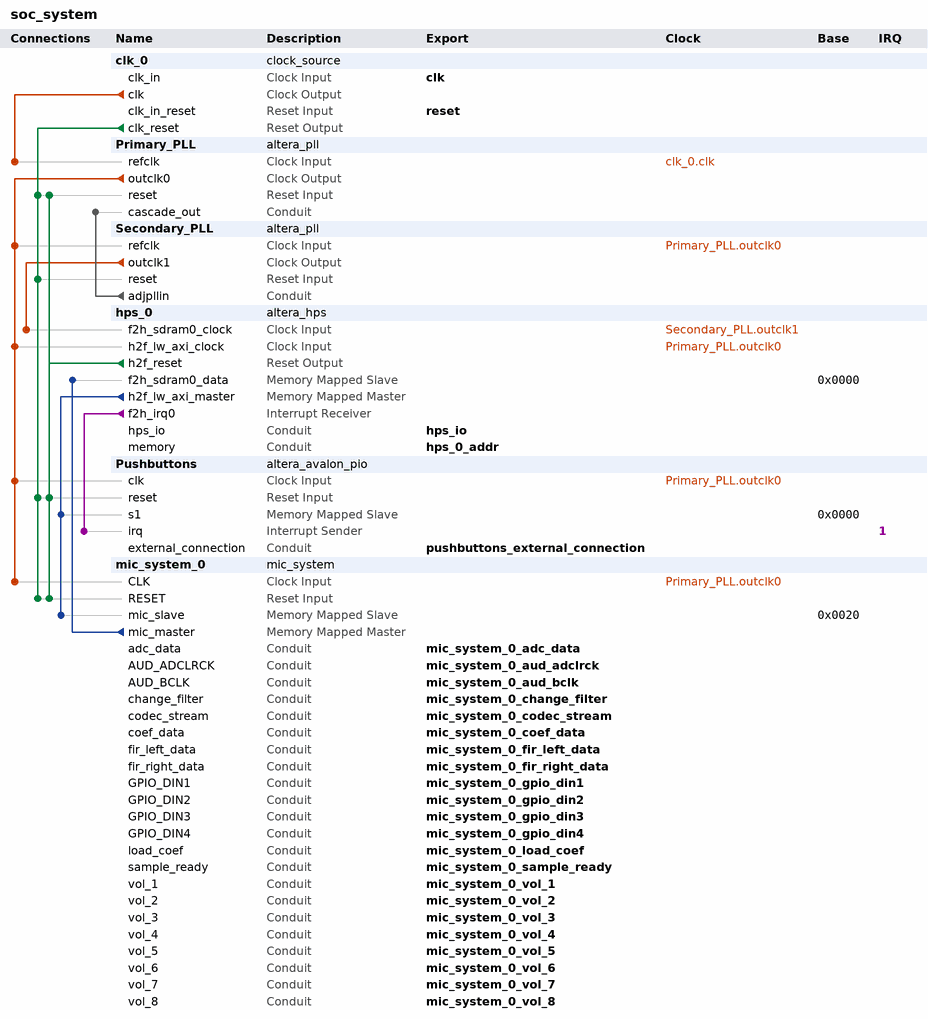
[diagram p0: system contents]
# Platform Designer (Qsys) system soc_system, Cyclone V 5CSEMA5F31C6
# Parameters at their usual value, and those the tool derives, are not listed.
package require -exact qsys 17.1
create_system soc_system
set_project_property DEVICE_FAMILY {Cyclone V}
set_project_property DEVICE 5CSEMA5F31C6

add_instance clk_0 clock_source 17.1
set_instance_parameter_value clk_0 clockFrequency 50000000

add_instance Primary_PLL altera_pll 17.1
set_instance_parameter_value Primary_PLL gui_device_speed_grade 1
set_instance_parameter_value Primary_PLL gui_enable_cascade_out true
set_instance_parameter_value Primary_PLL gui_number_of_clocks 1
set_instance_parameter_value Primary_PLL gui_operation_mode normal
set_instance_parameter_value Primary_PLL gui_output_clock_frequency0 48.0
set_instance_parameter_value Primary_PLL gui_pll_mode {Integer-N PLL}
set_instance_parameter_value Primary_PLL gui_reference_clock_frequency 50.0
set_instance_parameter_value Primary_PLL gui_use_locked false

add_instance Secondary_PLL altera_pll 17.1
set_instance_parameter_value Secondary_PLL gui_device_speed_grade 1
set_instance_parameter_value Secondary_PLL gui_enable_cascade_in true
set_instance_parameter_value Secondary_PLL gui_number_of_clocks 2
set_instance_parameter_value Secondary_PLL gui_operation_mode direct
set_instance_parameter_value Secondary_PLL gui_output_clock_frequency0 48.0
set_instance_parameter_value Secondary_PLL gui_output_clock_frequency1 96.0
set_instance_parameter_value Secondary_PLL gui_pll_mode {Integer-N PLL}
set_instance_parameter_value Secondary_PLL gui_reference_clock_frequency 48.0
set_instance_parameter_value Secondary_PLL gui_use_locked false

add_instance hps_0 altera_hps 17.1
set_instance_parameter_value hps_0 EMAC1_Mode RGMII
set_instance_parameter_value hps_0 EMAC1_PinMuxing {HPS I/O Set 0}
set_instance_parameter_value hps_0 F2SCLK_COLDRST_Enable false
set_instance_parameter_value hps_0 F2SCLK_DBGRST_Enable false
set_instance_parameter_value hps_0 F2SCLK_WARMRST_Enable false
set_instance_parameter_value hps_0 F2SDRAM_Type {Avalon-MM Bidirectional}
set_instance_parameter_value hps_0 F2SDRAM_Width 32
set_instance_parameter_value hps_0 F2SINTERRUPT_Enable true
set_instance_parameter_value hps_0 F2S_Width 0
set_instance_parameter_value hps_0 FPGA_PERIPHERAL_OUTPUT_CLOCK_FREQ_EMAC0_GTX_CLK 125
set_instance_parameter_value hps_0 FPGA_PERIPHERAL_OUTPUT_CLOCK_FREQ_EMAC0_MD_CLK 2.5
set_instance_parameter_value hps_0 FPGA_PERIPHERAL_OUTPUT_CLOCK_FREQ_EMAC1_GTX_CLK 125
set_instance_parameter_value hps_0 FPGA_PERIPHERAL_OUTPUT_CLOCK_FREQ_EMAC1_MD_CLK 2.5
set_instance_parameter_value hps_0 HPS_PROTOCOL DDR3
set_instance_parameter_value hps_0 I2C0_Mode I2C
set_instance_parameter_value hps_0 I2C0_PinMuxing {HPS I/O Set 0}
set_instance_parameter_value hps_0 I2C1_Mode I2C
set_instance_parameter_value hps_0 I2C1_PinMuxing {HPS I/O Set 1}
set_instance_parameter_value hps_0 LWH2F_Enable true
set_instance_parameter_value hps_0 MEM_BANKADDR_WIDTH 3
set_instance_parameter_value hps_0 MEM_CLK_FREQ 400.0
set_instance_parameter_value hps_0 MEM_COL_ADDR_WIDTH 10
set_instance_parameter_value hps_0 MEM_DQ_WIDTH 32
set_instance_parameter_value hps_0 MEM_DRV_STR RZQ/7
set_instance_parameter_value hps_0 MEM_ROW_ADDR_WIDTH 15
set_instance_parameter_value hps_0 MEM_RTT_NOM RZQ/4
set_instance_parameter_value hps_0 MEM_RTT_WR RZQ/4
set_instance_parameter_value hps_0 MEM_TCL 11
set_instance_parameter_value hps_0 MEM_TFAW_NS 30.0
set_instance_parameter_value hps_0 MEM_TRAS_NS 35.0
set_instance_parameter_value hps_0 MEM_TRCD_NS 13.75
set_instance_parameter_value hps_0 MEM_TRFC_NS 260.0
set_instance_parameter_value hps_0 MEM_TRP_NS 13.75
set_instance_parameter_value hps_0 MEM_VENDOR Other
set_instance_parameter_value hps_0 MEM_WTCL 8
set_instance_parameter_value hps_0 QSPI_Mode {1 SS}
set_instance_parameter_value hps_0 QSPI_PinMuxing {HPS I/O Set 0}
set_instance_parameter_value hps_0 REF_CLK_FREQ 125.0
set_instance_parameter_value hps_0 S2FCLK_USER2CLK 5
set_instance_parameter_value hps_0 S2F_Width 0
set_instance_parameter_value hps_0 SDIO_Mode {4-bit Data}
set_instance_parameter_value hps_0 SDIO_PinMuxing {HPS I/O Set 0}
set_instance_parameter_value hps_0 SPIM1_Mode {Single Slave Select}
set_instance_parameter_value hps_0 SPIM1_PinMuxing {HPS I/O Set 0}
set_instance_parameter_value hps_0 STM_Enable false
set_instance_parameter_value hps_0 TIMING_BOARD_AC_SKEW 0.02
set_instance_parameter_value hps_0 TIMING_BOARD_AC_TO_CK_SKEW 0.01
set_instance_parameter_value hps_0 TIMING_BOARD_DQ_TO_DQS_SKEW 0.05
set_instance_parameter_value hps_0 TIMING_BOARD_MAX_CK_DELAY 0.03
set_instance_parameter_value hps_0 TIMING_BOARD_MAX_DQS_DELAY 0.02
set_instance_parameter_value hps_0 TIMING_BOARD_SKEW_BETWEEN_DQS 0.06
set_instance_parameter_value hps_0 TIMING_BOARD_SKEW_CKDQS_DIMM_MAX 0.12
set_instance_parameter_value hps_0 TIMING_BOARD_SKEW_CKDQS_DIMM_MIN 0.06
set_instance_parameter_value hps_0 TIMING_BOARD_SKEW_WITHIN_DQS 0.01
set_instance_parameter_value hps_0 TIMING_TDH 65
set_instance_parameter_value hps_0 TIMING_TDQSCK 255
set_instance_parameter_value hps_0 TIMING_TDQSQ 125
set_instance_parameter_value hps_0 TIMING_TDS 30
set_instance_parameter_value hps_0 TIMING_TIH 140
set_instance_parameter_value hps_0 TIMING_TIS 180
set_instance_parameter_value hps_0 TIMING_TQSH 0.4
set_instance_parameter_value hps_0 UART0_Mode {No Flow Control}
set_instance_parameter_value hps_0 UART0_PinMuxing {HPS I/O Set 0}
set_instance_parameter_value hps_0 USB1_Mode SDR
set_instance_parameter_value hps_0 USB1_PinMuxing {HPS I/O Set 0}
set_instance_parameter_value hps_0 desired_cfg_clk_mhz 100.0
set_instance_parameter_value hps_0 desired_qspi_clk_mhz 400.0

add_instance Pushbuttons altera_avalon_pio 17.1
set_instance_parameter_value Pushbuttons bitClearingEdgeCapReg true
set_instance_parameter_value Pushbuttons captureEdge true
set_instance_parameter_value Pushbuttons direction Input
set_instance_parameter_value Pushbuttons edgeType FALLING
set_instance_parameter_value Pushbuttons generateIRQ true
set_instance_parameter_value Pushbuttons irqType EDGE
set_instance_parameter_value Pushbuttons simDoTestBenchWiring true
set_instance_parameter_value Pushbuttons width 4

add_instance mic_system_0 mic_system 1.0

# connections
add_connection clk_0.clk Primary_PLL.refclk clock
add_connection Primary_PLL.outclk0 hps_0.h2f_lw_axi_clock clock
add_connection Primary_PLL.outclk0 mic_system_0.CLK clock
add_connection Primary_PLL.outclk0 Pushbuttons.clk clock
add_connection Primary_PLL.outclk0 Secondary_PLL.refclk clock
add_connection Secondary_PLL.outclk1 hps_0.f2h_sdram0_clock clock
add_connection clk_0.clk_reset mic_system_0.RESET reset
add_connection clk_0.clk_reset Primary_PLL.reset reset
add_connection clk_0.clk_reset Pushbuttons.reset reset
add_connection clk_0.clk_reset Secondary_PLL.reset reset
add_connection hps_0.h2f_reset mic_system_0.RESET reset
add_connection hps_0.h2f_reset Primary_PLL.reset reset
add_connection hps_0.h2f_reset Pushbuttons.reset reset
add_connection hps_0.h2f_lw_axi_master mic_system_0.mic_slave avalon
set_connection_parameter_value hps_0.h2f_lw_axi_master/mic_system_0.mic_slave baseAddress 0x0020
add_connection hps_0.h2f_lw_axi_master Pushbuttons.s1 avalon
set_connection_parameter_value hps_0.h2f_lw_axi_master/Pushbuttons.s1 baseAddress 0x0000
add_connection mic_system_0.mic_master hps_0.f2h_sdram0_data avalon
set_connection_parameter_value mic_system_0.mic_master/hps_0.f2h_sdram0_data baseAddress 0x0000
add_connection Secondary_PLL.adjpllin Primary_PLL.cascade_out conduit
add_connection hps_0.f2h_irq0 Pushbuttons.irq interrupt
set_connection_parameter_value hps_0.f2h_irq0/Pushbuttons.irq irqNumber 1

# exported interfaces
add_interface clk clock sink
set_interface_property clk EXPORT_OF clk_0.clk_in
add_interface hps_0_addr conduit end
set_interface_property hps_0_addr EXPORT_OF hps_0.memory
add_interface hps_io conduit end
set_interface_property hps_io EXPORT_OF hps_0.hps_io
add_interface mic_system_0_adc_data conduit end
set_interface_property mic_system_0_adc_data EXPORT_OF mic_system_0.adc_data
add_interface mic_system_0_aud_adclrck conduit end
set_interface_property mic_system_0_aud_adclrck EXPORT_OF mic_system_0.AUD_ADCLRCK
add_interface mic_system_0_aud_bclk conduit end
set_interface_property mic_system_0_aud_bclk EXPORT_OF mic_system_0.AUD_BCLK
add_interface mic_system_0_change_filter conduit end
set_interface_property mic_system_0_change_filter EXPORT_OF mic_system_0.change_filter
add_interface mic_system_0_codec_stream conduit end
set_interface_property mic_system_0_codec_stream EXPORT_OF mic_system_0.codec_stream
add_interface mic_system_0_coef_data conduit end
set_interface_property mic_system_0_coef_data EXPORT_OF mic_system_0.coef_data
add_interface mic_system_0_fir_left_data conduit end
set_interface_property mic_system_0_fir_left_data EXPORT_OF mic_system_0.fir_left_data
add_interface mic_system_0_fir_right_data conduit end
set_interface_property mic_system_0_fir_right_data EXPORT_OF mic_system_0.fir_right_data
add_interface mic_system_0_gpio_din1 conduit end
set_interface_property mic_system_0_gpio_din1 EXPORT_OF mic_system_0.GPIO_DIN1
add_interface mic_system_0_gpio_din2 conduit end
set_interface_property mic_system_0_gpio_din2 EXPORT_OF mic_system_0.GPIO_DIN2
add_interface mic_system_0_gpio_din3 conduit end
set_interface_property mic_system_0_gpio_din3 EXPORT_OF mic_system_0.GPIO_DIN3
add_interface mic_system_0_gpio_din4 conduit end
set_interface_property mic_system_0_gpio_din4 EXPORT_OF mic_system_0.GPIO_DIN4
add_interface mic_system_0_load_coef conduit end
set_interface_property mic_system_0_load_coef EXPORT_OF mic_system_0.load_coef
add_interface mic_system_0_sample_ready conduit end
set_interface_property mic_system_0_sample_ready EXPORT_OF mic_system_0.sample_ready
add_interface mic_system_0_vol_1 conduit end
set_interface_property mic_system_0_vol_1 EXPORT_OF mic_system_0.vol_1
add_interface mic_system_0_vol_2 conduit end
set_interface_property mic_system_0_vol_2 EXPORT_OF mic_system_0.vol_2
add_interface mic_system_0_vol_3 conduit end
set_interface_property mic_system_0_vol_3 EXPORT_OF mic_system_0.vol_3
add_interface mic_system_0_vol_4 conduit end
set_interface_property mic_system_0_vol_4 EXPORT_OF mic_system_0.vol_4
add_interface mic_system_0_vol_5 conduit end
set_interface_property mic_system_0_vol_5 EXPORT_OF mic_system_0.vol_5
add_interface mic_system_0_vol_6 conduit end
set_interface_property mic_system_0_vol_6 EXPORT_OF mic_system_0.vol_6
add_interface mic_system_0_vol_7 conduit end
set_interface_property mic_system_0_vol_7 EXPORT_OF mic_system_0.vol_7
add_interface mic_system_0_vol_8 conduit end
set_interface_property mic_system_0_vol_8 EXPORT_OF mic_system_0.vol_8
add_interface pushbuttons_external_connection conduit end
set_interface_property pushbuttons_external_connection EXPORT_OF Pushbuttons.external_connection
add_interface reset reset sink
set_interface_property reset EXPORT_OF clk_0.clk_in_reset

set_interconnect_requirement {$system} qsys_mm.clockCrossingAdapter HANDSHAKE
set_interconnect_requirement {$system} qsys_mm.maxAdditionalLatency 1

save_system soc_system.qsys
